# EAGLE design LDAQ-MOD-ENC4 (EAGLE 7.5.0)
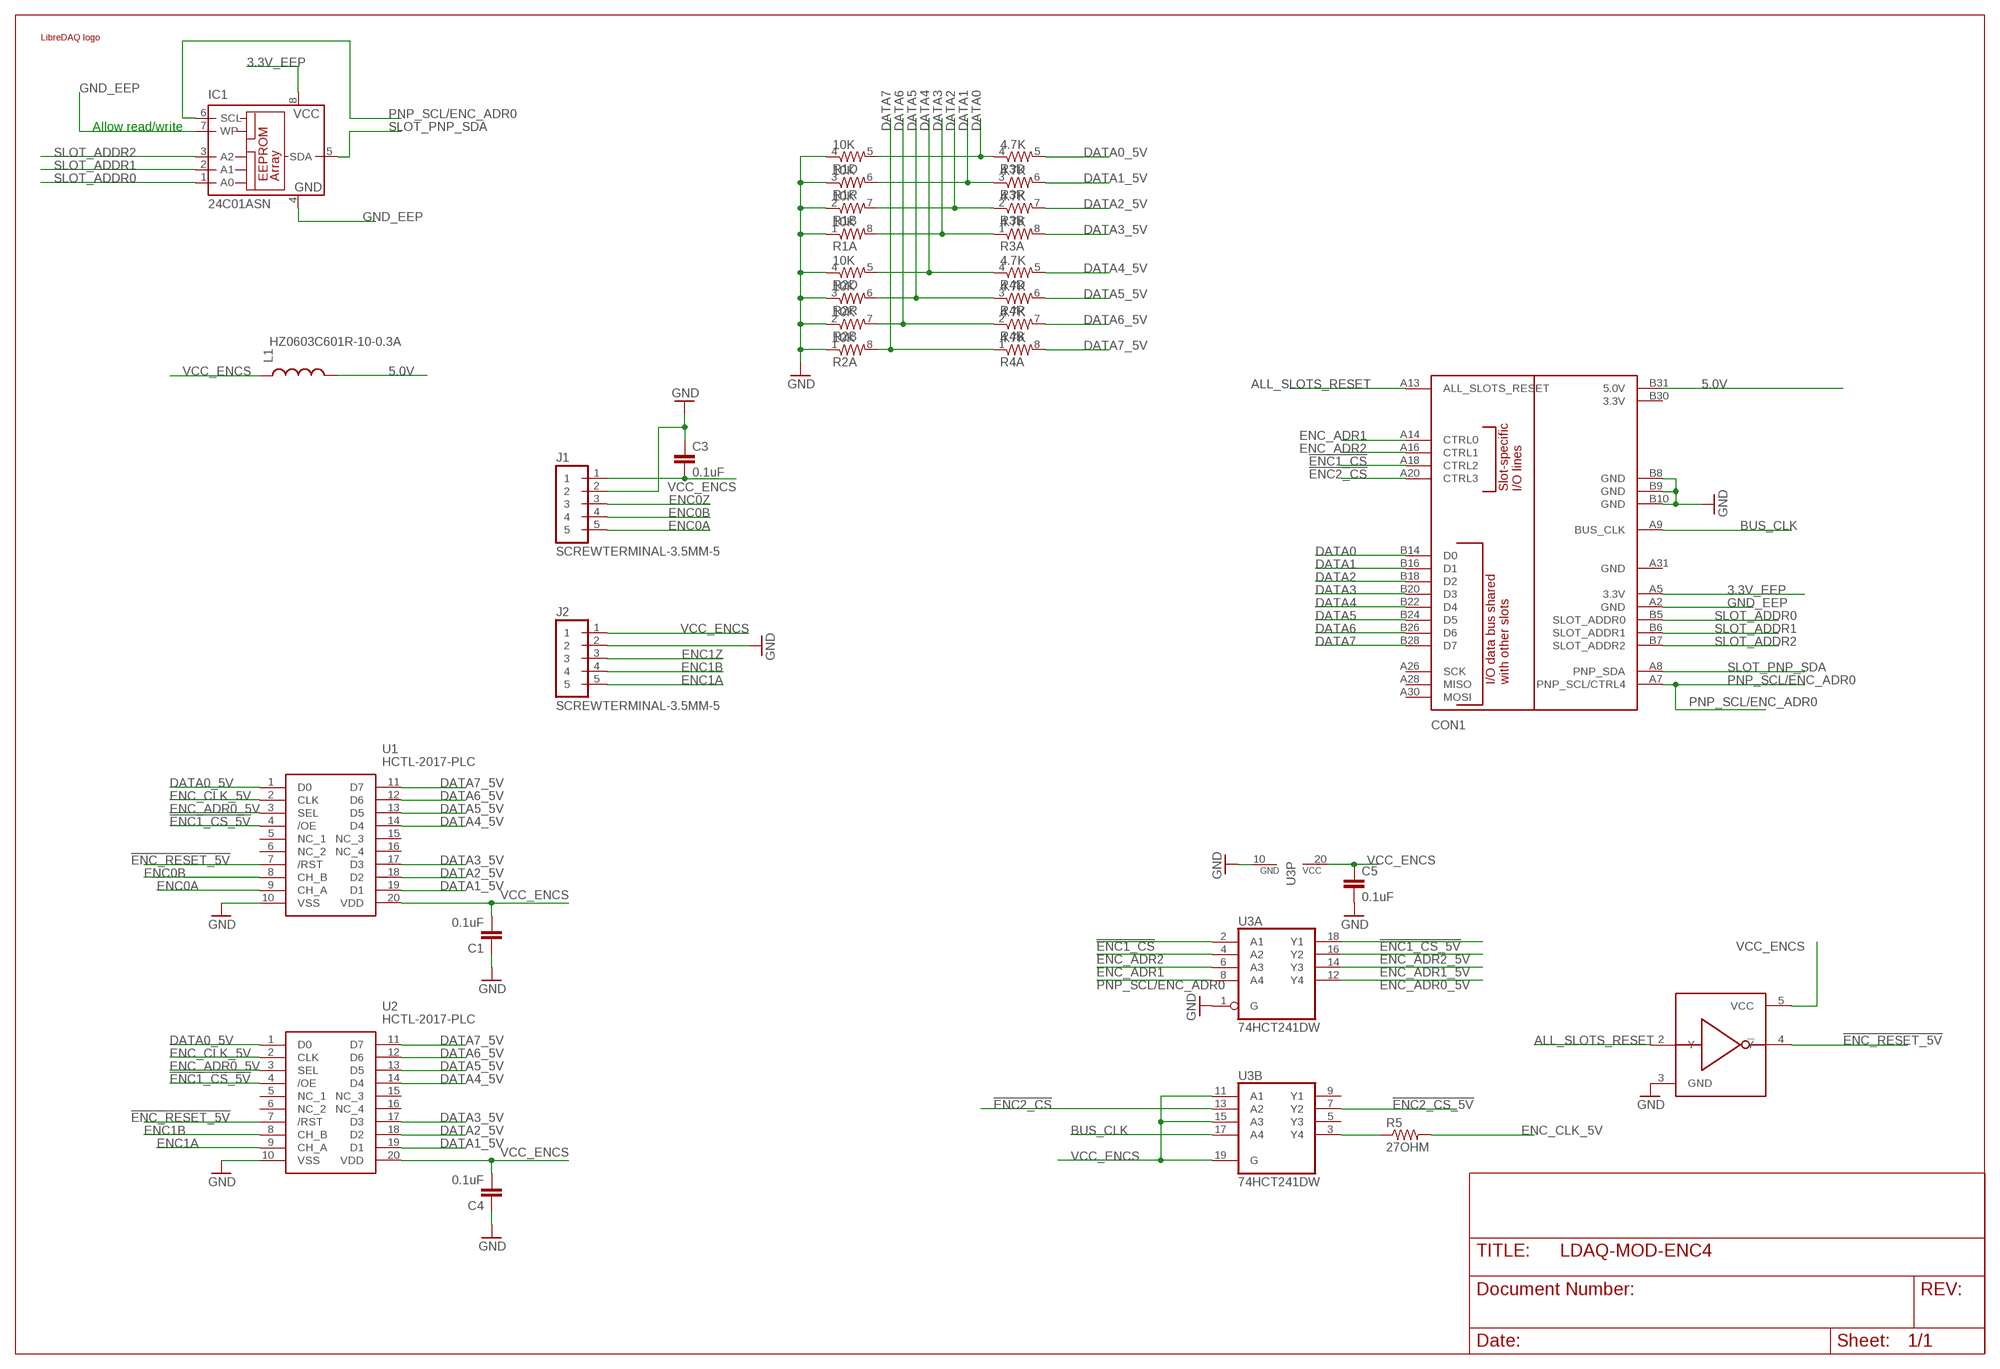
[diagram p0: schematic, sheet 1]

## Parts
C1  0.1uF  0.1UF-25V(+80/-20%)(0603)  [0603-CAP]
C3  0.1uF  0.1UF-25V(+80/-20%)(0603)  [0603-CAP]
C4  0.1uF  0.1UF-25V(+80/-20%)(0603)  [0603-CAP]
C5  0.1uF  0.1UF-25V(+80/-20%)(0603)  [0603-CAP]
CON1  BOARD  LIBREDAQ_DAUGHTER_BOARDPCI-64-SIZE1-PADS  [PCI-E_64_EDGE_70X60_PADS-ONLY]
IC1  24C01ASN  [SO-08]
J1  SCREWTERMINAL-3.5MM-5  [SCREWTERMINAL-3.5MM-5]
J2  SCREWTERMINAL-3.5MM-5  [SCREWTERMINAL-3.5MM-5]
L1  HZ0603C601R-10-0.3A  INDUCTOR0603  [0603]
LOGO1  LIBREDAQ_LOGO_MINILOGO_GENERIC  [LIBREDAQ_LOGO]
R1  10K  RESISTOR-ARRAY0603-ARV  [0603-ARV]
R2  10K  RESISTOR-ARRAY0603-ARV  [0603-ARV]
R3  4.7K  RESISTOR-ARRAY0603-ARV  [0603-ARV]
R4  4.7K  RESISTOR-ARRAY0603-ARV  [0603-ARV]
R5  27OHM  33OHM1/10W1%(0603)  [0603]
U1  HCTL-2017-PLC  [PLCC127P991X991X457-20N]
U2  HCTL-2017-PLC  [PLCC127P991X991X457-20N]
U3  74HCT241DW  [SO20W]
U4  74AHCT1G04  [SOT353-SC70-5]

## Nets
3.3V_EEP: CON1.A5(3.3V) IC1.8(VCC)
5.0V: CON1.B31(5.0V) L1.2
!ENC1_CS: CON1.A18(CTRL2) U3.2(A:A1)
!ENC1_CS_5V: U1.4(/OE) U2.4(/OE) U3.18(A:Y1)
!ENC2_CS: CON1.A20(CTRL3) U3.13(B:A2)
!ENC2_CS_5V: U3.7(B:Y2)
!ENC_RESET_5V: U1.7(/RST) U2.7(/RST) U4.4(!Y)
ALL_SLOTS_RESET: CON1.A13(ALL_SLOTS_RESET) U4.2(Y)
BUS_CLK: CON1.A9(BUS_CLK) U3.17(B:A4)
DATA0: CON1.B14(D0) R1.5 R3.4
DATA0_5V: R3.5 U1.1(D0) U2.1(D0)
DATA1: CON1.B16(D1) R1.6 R3.3
DATA1_5V: R3.6 U1.19(D1) U2.19(D1)
DATA2: CON1.B18(D2) R1.7 R3.2
DATA2_5V: R3.7 U1.18(D2) U2.18(D2)
DATA3: CON1.B20(D3) R1.8 R3.1
DATA3_5V: R3.8 U1.17(D3) U2.17(D3)
DATA4: CON1.B22(D4) R2.5 R4.4
DATA4_5V: R4.5 U1.14(D4) U2.14(D4)
DATA5: CON1.B24(D5) R2.6 R4.3
DATA5_5V: R4.6 U1.13(D5) U2.13(D5)
DATA6: CON1.B26(D6) R2.7 R4.2
DATA6_5V: R4.7 U1.12(D6) U2.12(D6)
DATA7: CON1.B28(D7) R2.8 R4.1
DATA7_5V: R4.8 U1.11(D7) U2.11(D7)
ENC0A: J1.5 U1.9(CH_A)
ENC0B: J1.4 U1.8(CH_B)
ENC0Z: J1.3
ENC1A: J2.5 U2.9(CH_A)
ENC1B: J2.4 U2.8(CH_B)
ENC1Z: J2.3
ENC_ADR0_5V: U1.3(SEL) U2.3(SEL) U3.12(A:Y4)
ENC_ADR1: CON1.A14(CTRL0) U3.6(A:A3)
ENC_ADR1_5V: U3.14(A:Y3)
ENC_ADR2: CON1.A16(CTRL1) U3.4(A:A2)
ENC_ADR2_5V: U3.16(A:Y2)
ENC_CLK_5V: R5.2 U1.2(CLK) U2.2(CLK)
GND: C1.1 C3.1 C4.1 C5.2 CON1.B8(GND) CON1.B9(GND) CON1.B10(GND) J1.2 J2.2 R1.1 R1.2 R1.3 R1.4 R2.1 R2.2 R2.3 R2.4 U1.10(VSS) U2.10(VSS) U3.1(A:G) U3.10(P:GND) U4.3(GND)
GND_EEP: CON1.A2(GND) IC1.4(GND) IC1.7(WP)
N$1: R5.1 U3.3(B:Y4)
PNP_SCL/ENC_ADR0: CON1.A7(PNP_SCL/CTRL4) IC1.6(SCL) U3.8(A:A4)
SLOT_ADDR0: CON1.B5(SLOT_ADDR0) IC1.1(A0)
SLOT_ADDR1: CON1.B6(SLOT_ADDR1) IC1.2(A1)
SLOT_ADDR2: CON1.B7(SLOT_ADDR2) IC1.3(A2)
SLOT_PNP_SDA: CON1.A8(PNP_SDA) IC1.5(SDA)
VCC_ENCS: C1.2 C3.2 C4.2 C5.1 J1.1 J2.1 L1.1 U1.20(VDD) U2.20(VDD) U3.11(B:A1) U3.15(B:A3) U3.19(B:G) U3.20(P:VCC) U4.5(VCC)
Unconnected: CON1.A26(SCK) CON1.A28(MISO) CON1.A30(MOSI) CON1.A31(GND) CON1.B30(3.3V) U1.5(NC_1) U1.6(NC_2) U1.15(NC_3) U1.16(NC_4) U2.5(NC_1) U2.6(NC_2) U2.15(NC_3) U2.16(NC_4) U3.5(B:Y3) U3.9(B:Y1)

## Notes on the sheet
- Allow read/write

## Library data of the parts
C1 C3-C5 = SparkFun-Capacitors:0.1UF-25V(+80/-20%)(0603): CAP-00810 Ceramic Standard decoupling cap; PROD_ID: CAP-00810
CON1 = libredaq-comps:LIBREDAQ_DAUGHTER_BOARD: LibreDAQ Expansion board (PCI-E form)
IC1 = libredaq-comps:24C*: Serial EEPROM 1 K/2 K/4 K; MPN: AT24C01BN-SH-B; OC_FARNELL: 1362638; OC_NEWARK: 50M3313
J1 J2 = libredaq-comps:SCREWTERMINAL-3.5MM-5
L1 = SparkFun-Passives:INDUCTOR: Inductors Basic Inductor/Choke - 0603 and 1206. Footprints are not proven and vary greatly between part numbers. SRN6045- 33uH, 20% 1.4A SDR0403-560KL - 56uH, 10%, 500mA RMS/740mA peak
LOGO1 = libredaq-comps:LIBREDAQ_LOGO_MINI
R1-R4 = SparkFun-Resistors:RESISTOR-ARRAY: Array Chip Resistor Source: RS Component / Phycomp
R5 = SparkFun-Resistors:33OHM1/10W1%(0603): RES-08270; PROD_ID: RES-08270; VALUE: 33OHM
U1 U2 = SamacSys_Parts:HCTL-2017-PLC: Avago, Motion Control, HCTL-2017-PLC Broadcom HCTL-2017-PLC, Dual, Counter, Decoder, 1-of-8, Inverting, 4.5 to 5.5 V, 20-Pin PLCC Source: Datasheet <https://docs.broadcom.com/docs/AV01-0041EN>; DESCRIPTION: Avago, Motion Control, HCTL-2017-PLC Broadcom HCTL-2017-PLC, Dual, Counter, Decoder, 1-of-8, Inverting, 4.5 to 5.5 V, 20-Pin PLCC; HEIGHT: 4.572mm; MANUFACTURER_NAME: Avago Technologies; MANUFACTURER_PART_NUMBER: HCTL-2017-PLC
U3 = libredaq-comps:74*241: Octal BUFFER and LINE DRIVER, 3-state
U4 = libredaq-comps:74AHCT1G04: 74AHCT1G04SE: 1 gate inverter

## Board
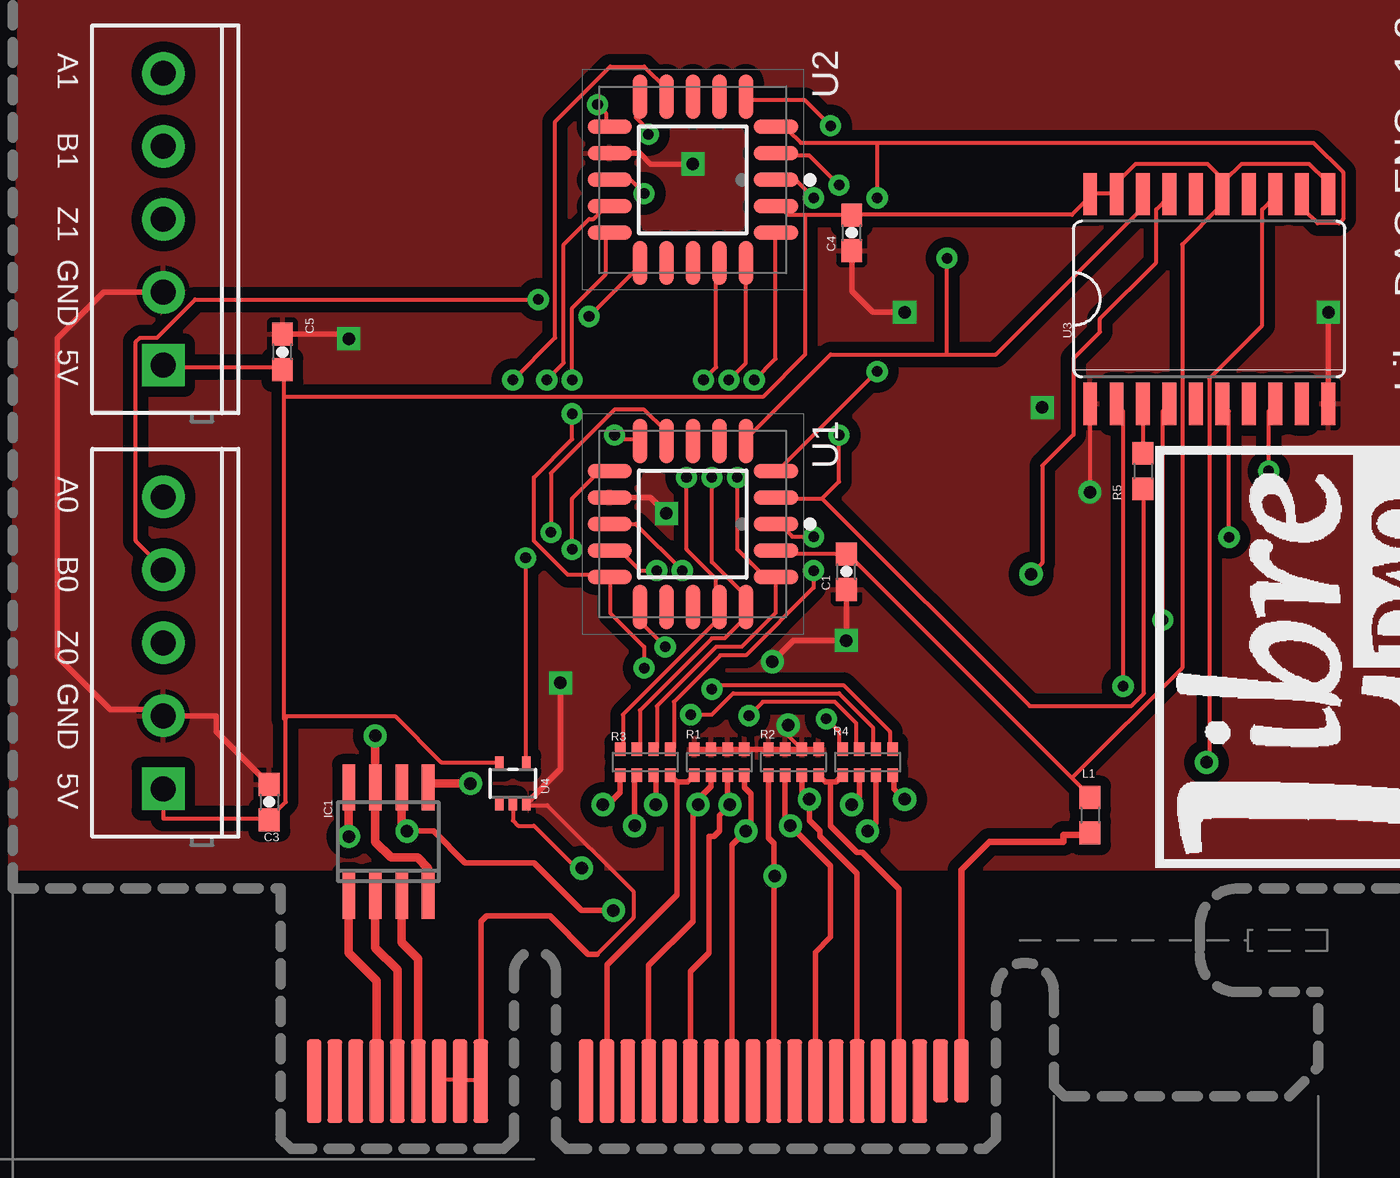
[diagram p1: board, top side]
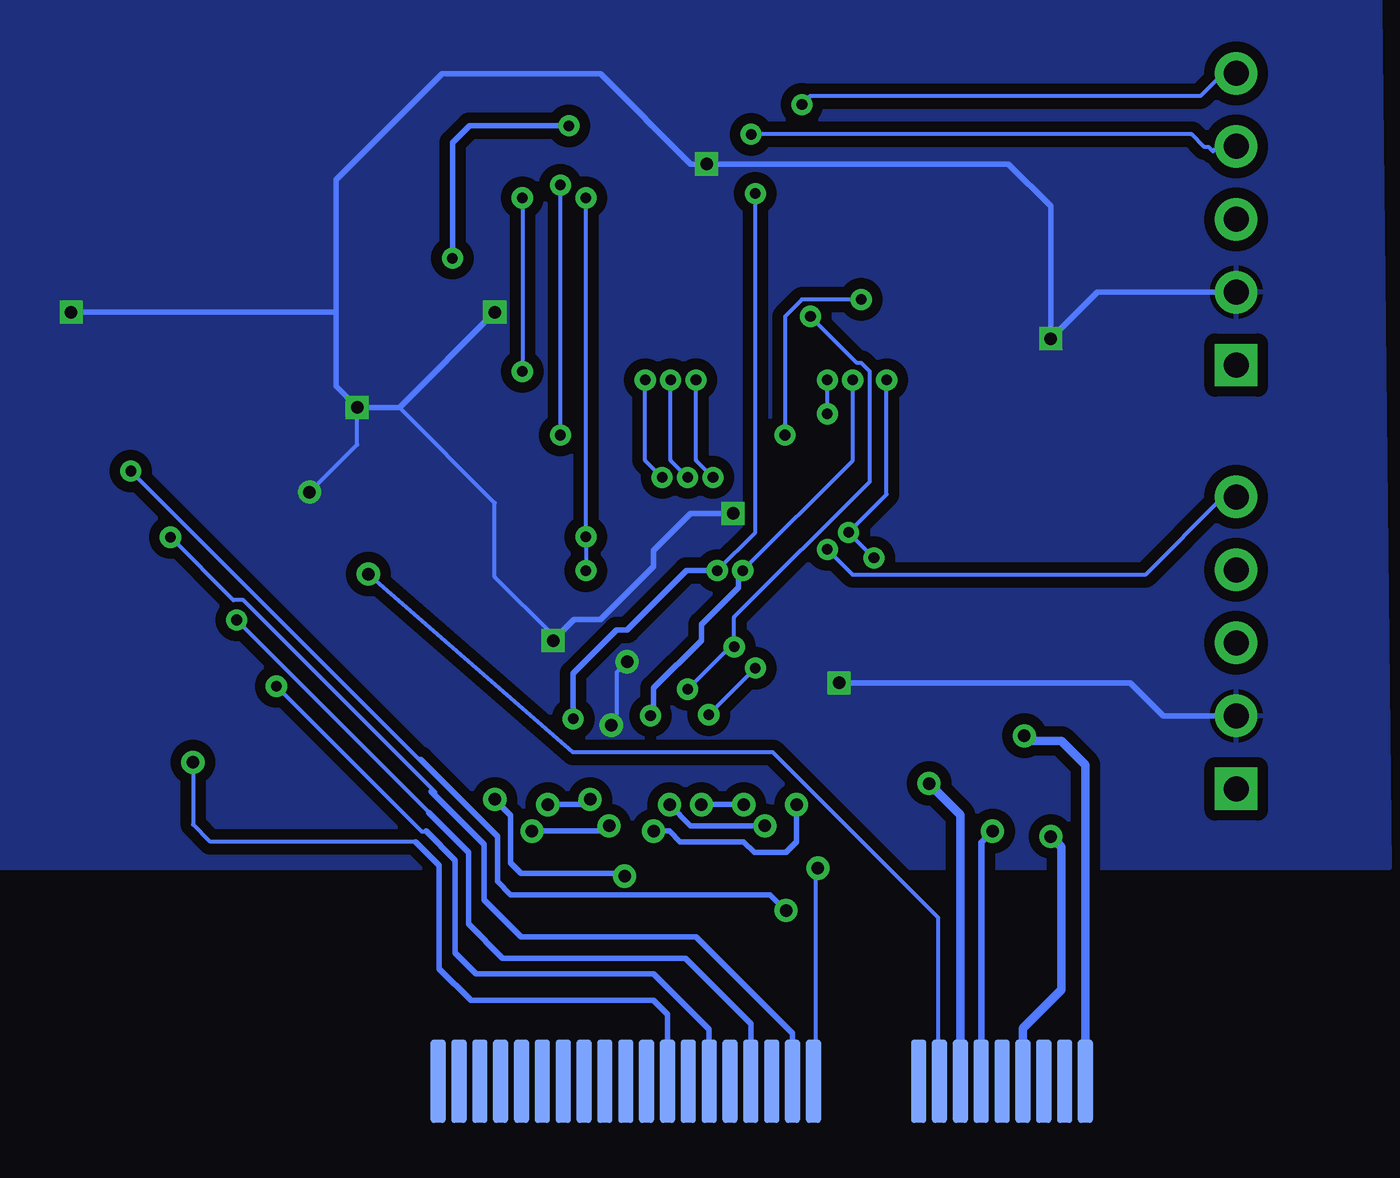
[diagram p2: board, bottom side, seen from below]

No outline drawn. Coordinates in mm, seen from the top.
Copper layers (1*16): Top 0.035mm / dielectric 1.5mm / Bottom 0.035mm
Design rules "LibreDAQ": minimum track width 8mil, minimum drill 20mil, track to track 8mil, track to pad 7mil, pad to pad 7mil, via to via 8mil, smd to smd 7mil, copper to edge 6mil, drill to drill 8mil, minimum pad ring 12mil, minimum via ring 10mil, stop-mask expansion 4mil, vias tented up to drill 25mil, thermal gap 10mil
tKeepout: 31 lines
bKeepout: 32 lines

### Footprints (pad centres in the part's own frame; a part is rotated, then mirrored left to right if it is on the bottom)
0603-CAP = smd 1.1 x 1: 1 -0.85,0; 2 0.85,0
PCI-E_64_EDGE_70X60_PADS-ONLY = smd 0.7 x 4 bottom: A2 -10.55,3.75; A3 -9.55,3.75; A4 -8.55,3.75; A5 -7.55,3.75; A6 -6.55,3.75; A7 -5.55,3.75; A8 -4.55,3.75; A9 -3.55,3.75; A10 -2.55,3.75; A13 2.5,3.75; A14 3.5,3.75; A15 4.5,3.75; A16 5.5,3.75; A17 6.5,3.75; A18 7.5,3.75; A19 8.5,3.75; A20 9.5,3.75; A21 10.5,3.75; A22 11.5,3.75; A23 12.5,3.75; A24 13.5,3.75; A25 14.5,3.75; A26 15.5,3.75; A27 16.5,3.75; A28 17.5,3.75; A29 18.5,3.75; A30 19.5,3.75; A31 20.5,3.75 | smd 0.7 x 4: B2 -10.55,3.75; B3 -9.55,3.75; B4 -8.55,3.75; B5 -7.55,3.75; B6 -6.55,3.75; B7 -5.55,3.75; B8 -4.55,3.75; B9 -3.55,3.75; B10 -2.55,3.75; B13 2.5,3.75; B14 3.5,3.75; B15 4.5,3.75; B16 5.5,3.75; B17 6.5,3.75; B18 7.5,3.75; B19 8.5,3.75; B20 9.5,3.75; B21 10.5,3.75; B22 11.5,3.75; B23 12.5,3.75; B24 13.5,3.75; B25 14.5,3.75; B26 15.5,3.75; B27 16.5,3.75; B28 17.5,3.75; B29 18.5,3.75 | smd 0.7 x 3: B30 19.5,4.25; B31 20.5,4.25
SO-08 = smd 0.6 x 2.2: 1 -1.905,-2.6; 2 -0.635,-2.6; 3 0.635,-2.6; 4 1.905,-2.6; 5 1.905,2.6; 6 0.635,2.6; 7 -0.635,2.6; 8 -1.905,2.6
SCREWTERMINAL-3.5MM-5 = drill 1.2 pad 2.032 square: 1 0,0 | drill 1.2 pad 2.032: 2 3.5,0; 3 7,0; 4 10.5,0; 5 14,0
0603 = smd 1.1 x 1: 1 -0.85,0; 2 0.85,0
0603-ARV = smd 0.5 x 0.65: 1 -1.2,-0.625; 2 -0.4,-0.625; 3 0.4,-0.625; 4 1.2,-0.625; 5 1.2,0.625; 6 0.4,0.625; 7 -0.4,0.625; 8 -1.2,0.625
PLCC127P991X991X457-20N = smd 0.7 x 2.129: 1 0,3.986; 2 -1.27,3.986; 3 -2.54,3.986; 9 -2.54,-3.986; 10 -1.27,-3.986; 11 0,-3.986; 12 1.27,-3.986; 13 2.54,-3.986; 19 2.54,3.986; 20 1.27,3.986 | smd 2.129 x 0.7: 4 -3.986,2.54; 5 -3.986,1.27; 6 -3.986,0; 7 -3.986,-1.27; 8 -3.986,-2.54; 14 3.986,-2.54; 15 3.986,-1.27; 16 3.986,0; 17 3.986,1.27; 18 3.986,2.54
SO20W = smd 0.66 x 2.032: 1 -5.715,-5.029; 2 -4.445,-5.029; 3 -3.175,-5.029; 4 -1.905,-5.029; 5 -0.635,-5.029; 6 0.635,-5.029; 7 1.905,-5.029; 8 3.175,-5.029; 9 4.445,-5.029; 10 5.715,-5.029; 11 5.715,5.029; 12 4.445,5.029; 13 3.175,5.029; 14 1.905,5.029; 15 0.635,5.029; 16 -0.635,5.029; 17 -1.905,5.029; 18 -3.175,5.029; 19 -4.445,5.029; 20 -5.715,5.029
SOT353-SC70-5 = smd 0.42 x 0.7: 1 -0.65,-0.95; 2 0,-0.95; 3 0.65,-0.95; 4 0.65,0.95; 5 -0.65,0.95

### Placement (x,y rotation side)
C1  40.39,28.19 90 top
C3  12.7,17.14 270 top
C4  40.64,44.45 90 top
C5  13.34,38.73 90 top
CON1  25.4,0 0 top
IC1  18.41,15.24 0 top
J1  7.62,17.78 90 top
J2  7.62,38.1 90 top
L1  52.07,16.51 270 top
LOGO1  70.1,13.97 90 top
R1  34.29,19.05 180 top
R2  37.85,19.05 180 top
R3  30.73,19.05 0 top
R4  41.4,19.05 0 top
R5  54.61,33.02 270 top
U1  33.02,30.48 270 top
U2  33.02,46.99 270 top
U3  57.78,41.27 0 top
U4  24.38,18.03 0 top

### Tracks (layer width: path | path; a pad name or v marks a point on that pad's centre or on a via)
3.3V_EEP  (via drill 0.6)
  Top 0.406: v16.51,15.49 IC1.8
  Bottom 0.406: CON1.A5 17.85,6.28 16,8.13 16,14.99 v16.51,15.49
5.0V
  Top 0.203: 52.07,15.56 L1.2
  Top 0.305: 52.07,15.56 50.8,15.56 50.8,15.24 47.24,15.24 45.9,13.9 CON1.B31
!ENC1_CS  (via drill 0.51)
  Top 0.203: v53.66,22.7 53.66,35.88 53.34,36.2 U3.2
  Bottom 0.203: v53.66,22.7 46.67,15.72 46.51,15.72 46.48,15.75
  Bottom 0.254: 46.48,15.75 45.09,14.35 45.09,9.91 44.07,8.89 35.56,8.89 32.9,6.23 CON1.A18
!ENC1_CS_5V  (via drill 0.51)
  Top 0.203: 45.21,38.61 39.62,38.61 35.56,34.54 U1.4 | 45.21,38.61 47.55,38.61 54.46,45.52 54.46,46.13 U3.18 | v39.62,49.58 38.41,50.8 35.56,50.8 U2.4 | 45.21,38.61 v45.21,43.23
  Bottom 0.254: v39.62,49.58 44.4,49.58 45.21,48.77 v45.21,43.23
!ENC2_CS  (via drill 0.6)
  Top 0.203: U3.13 60.96,46.2 60.33,45.56 60.33,40.01 57.78,37.47 57.78,19.18 v57.66,19.05
  Bottom 0.203: 46.99,15.24 56.83,15.24 57.66,16.07 v57.66,19.05
  Bottom 0.254: 46.99,15.24 45.85,14.1 45.85,9.14 44.32,7.62 35.56,7.62 34.9,6.96 CON1.A20
!ENC_RESET_5V  (via drill 0.51)
  Top 0.203: v24.99,28.85 24.99,19.1 U4.4 | v26.21,30.07 26.21,32.92 29.26,35.97 30.68,35.97 31.7,34.95 31.7,34.54 U1.7 | v24.38,37.39 26.42,39.42 26.42,49.78 29.06,52.43 30.68,52.43 31.7,51.41 31.7,51 U2.7
  Bottom 0.203: v24.99,28.85 v26.21,30.07 24.38,31.9 v24.38,37.39
ALL_SLOTS_RESET  (via drill 0.6)
  Top 0.203: v27.69,13.97 27.43,13.97 25.4,16 24.64,16 24.38,16.26 U4.2
  Bottom 0.203: CON1.A13 27.78,3.81 27.78,13.88 v27.69,13.97
BUS_CLK  (via drill 0.6)
  Top 0.203: U3.17 55.88,46.2 55.24,45.56 55.24,43.02 52.55,40.32 52.55,39.69 51.28,38.42 51.28,34.77 49.78,33.27 49.78,28.61 v49.25,28.08
  Bottom 0.203: v49.25,28.08 39.43,19.53 29.84,19.53 21.91,11.59 21.91,3.81 CON1.A9 | v49.25,28.08 49.34,28.16 v49.26,28.08 v49.25,28.08
DATA0
  Top 0.254: 32.26,18.1 32.26,12.7 28.9,9.34 CON1.B14 | 32.26,18.1 R3.4 | 32.26,18.1 32.77,18.1 R1.5
DATA0_5V  (via drill 0.51)
  Top 0.203: v38.81,28.25 38.81,27.43 35.56,24.18 34.34,24.18 32.11,21.95 32.11,19.71 R3.5 | v38.81,29.87 37.8,29.87 37.19,30.48 U1.1 | v38.81,46.13 38,46.94 37.19,46.94 U2.1
  Bottom 0.203: v38.81,28.25 v38.81,29.87 v38.81,46.13
DATA1  (via drill 0.6)
  Top 0.254: v31.24,17.02 31.24,18.32 R3.3 | 33.78,18.32 R1.6 33.89,17.89 33.27,17.27 v33.27,17.02 33.02,16.51 33.02,11.43 30.9,9.31 CON1.B16
  Bottom 0.254: v33.27,17.02 v31.24,17.02
DATA1_5V  (via drill 0.51)
  Top 0.203: R3.6 31.29,19.71 31.29,21.74 34.14,24.59 35.36,24.59 36.98,26.21 36.98,27.84 U1.19 36.98,28.04 36.37,28.04 35.15,29.26 v35.15,32.72 | v35.97,37.39 36.98,38.41 36.98,44.3 U2.19
  Bottom 0.203: v35.97,37.39 35.97,33.53 v35.15,32.72
DATA2  (via drill 0.6)
  Top 0.254: v30.23,16 30.23,18.32 R3.2 | R1.7 34.69,17.13 v34.8,17.02 34.29,16.51 34.29,15.75 34.04,15.49 33.78,15.49 33.78,9.91 32.9,9.02 CON1.B18
  Bottom 0.254: v30.23,16 33.78,16 v34.8,17.02
DATA2_5V  (via drill 0.51)
  Top 0.203: R3.7 30.48,19.71 30.48,21.54 33.93,24.99 34.54,24.99 35.56,26.01 U1.18 35.56,27.03 33.93,28.65 v33.93,32.72 | U2.18 35.56,38.2 v34.75,37.39
  Bottom 0.203: v34.75,37.39 34.75,33.53 v33.93,32.72
DATA3  (via drill 0.6)
  Top 0.254: R1.8 35.49,17.85 35.81,17.53 35.81,16 v35.56,15.75 34.9,15.09 CON1.B20 | v28.7,17.02 28.96,17.02 29.53,17.6 R3.1
  Bottom 0.254: v35.56,15.75 34.8,15.75 34.29,15.24 31.24,15.24 30.73,14.73 29.21,14.73 28.7,15.24 v28.7,17.02
DATA3_5V  (via drill 0.51)
  Top 0.203: R3.8 29.67,19.71 29.67,21.34 34.14,25.81 34.14,26.42 U1.17 34.14,26.62 34.14,27.84 32.72,29.26 v32.72,32.72 | v33.53,37.39 34.14,38 34.14,42.88 U2.17
  Bottom 0.203: v33.53,37.39 33.53,33.53 v32.72,32.72
DATA4  (via drill 0.6)
  Top 0.254: v43.18,17.27 42.67,17.78 42.67,18.36 R4.4 | R2.5 36.65,15.42 36.9,15.17 36.9,13.65 v36.96,13.59 36.9,13.53 CON1.B22
  Bottom 0.254: v43.18,17.27 42.42,16.51 42.42,14.22 41.91,13.72 37.08,13.72 v36.96,13.59
DATA4_5V  (via drill 0.51)
  Top 0.203: v33.93,22.55 34.14,22.76 40.23,22.76 42.47,20.52 42.47,19.71 R4.5 | v31.7,24.59 30.48,25.81 U1.14 | v28.04,40.44 30.48,42.88 U2.14
  Bottom 0.203: v33.93,22.55 31.9,24.59 v31.7,24.59 31.7,26.01 25.2,32.51 25.2,37.8 25.6,38.2 25.81,38.2 v28.04,40.44
DATA5  (via drill 0.6)
  Top 0.254: R4.3 41.8,16.15 v41.4,15.75 | R2.6 37.45,16.26 v37.7,16 39.62,14.08 39.62,10.67 38.9,9.94 CON1.B24
  Bottom 0.254: v41.4,15.75 37.95,15.75 v37.7,16
DATA5_5V  (via drill 0.51)
  Top 0.203: v32.92,21.34 33.93,21.34 34.95,22.35 40.03,22.35 41.66,20.73 41.66,19.71 R4.6 | v30.68,23.57 30.68,24.59 29.06,26.21 29.06,27.84 U1.13 28.85,28.04 27.03,28.04 25.4,29.67 25.4,32.72 27.23,34.54 v27.23,35.76 | v27.23,37.39 27.23,40.84 28.85,42.47 28.85,44.3 U2.13
  Bottom 0.203: v30.68,23.57 v32.92,21.34 | v27.23,35.76 v27.23,37.39
DATA6  (via drill 0.6)
  Top 0.254: R4.2 41,17.38 v40.64,17.02 | v38.61,17.27 38.35,17.53 | R2.7 38.25,17.63 v38.61,17.27 | v38.61,17.27 38.61,16.26 39.12,15.75 39.12,15.49 40.9,13.71 CON1.B26
  Bottom 0.254: v40.64,17.02 38.86,17.02 v38.61,17.27
DATA6_5V  (via drill 0.51)
  Top 0.203: v31.29,28.25 30.48,28.25 29.67,29.06 29.06,29.06 U1.12 | R4.7 40.84,19.71 40.84,20.93 39.83,21.95 36.37,21.95 v35.71,21.29 | v26.01,37.39 26.82,38.2 26.82,43.89 28.04,45.11 28.25,45.11 28.85,45.72 U2.12
  Bottom 0.203: v26.01,37.39 26.01,33.53 v31.29,28.25
  Bottom 0.254: v31.29,28.25 31.5,28.04 31.5,27.43 33.27,25.65 33.27,24.89 35.56,22.61 35.56,21.44 v35.71,21.29
DATA7
  Top 0.254: R2.8 39.37,18.1 39.62,18.1 | 39.62,18.1 39.88,18.1 R4.1 | 39.62,18.1 39.62,16 40.89,14.73 41.15,14.73 42.9,12.98 CON1.B28
DATA7_5V  (via drill 0.51)
  Top 0.203: v39.42,21.13 40.03,20.52 40.03,19.71 R4.8 | v32.51,28.25 30.28,30.48 U1.11 | v30.68,46.33 30.07,46.94 29.06,46.94 U2.11
  Bottom 0.203: v30.68,46.33 30.68,30.07 v32.51,28.25
  Bottom 0.254: v32.51,28.25 33.98,28.25 36.83,25.4 37.34,25.4 39.42,23.32 v39.42,21.13
ENC0A  (via drill 0.51)
  Top 0.203: v27.23,29.26 27.23,31.7 28.45,32.92 28.85,32.92 U1.9
  Bottom 0.203: v27.23,29.26 26.01,28.04 11.99,28.04 8.33,31.7 7.72,31.7 J1.5
ENC0B  (via drill 0.51)
  Top 0.203: v29.26,34.75 29.46,34.54 30.48,34.54 U1.8 | v25.6,41.25 9.14,41.25 7.32,39.42 6.5,39.42 6.3,39.22 6.3,29.67 7.52,28.45 J1.4
  Bottom 0.203: v29.26,34.75 29.26,40.44 28.45,41.25 v25.6,41.25
ENC1A  (via drill 0.51)
  Top 0.203: v28.45,50.6 28.85,50.19 28.85,49.58 U2.9
  Bottom 0.203: v28.45,50.6 28.04,51 9.35,51 8.33,52.02 7.72,52.02 J2.5
ENC1B  (via drill 0.51)
  Top 0.203: U2.8 30.48,50.19 30.28,49.99 30.89,49.38 v30.89,49.17
  Bottom 0.203: v30.89,49.17 9.75,49.17 9.14,48.56 8.94,48.56 8.74,48.36 8.53,48.56 7.72,48.56 J2.4
ENC_ADR0_5V  (via drill 0.51)
  Top 0.203: 41.86,48.77 38.2,48.77 37.59,49.38 37.19,49.38 U2.3 | 41.86,48.77 62.79,48.77 64.21,47.35 64.21,45.11 64.01,44.91 62.99,44.91 62.38,45.52 62.38,46.13 U3.12 | v41.86,37.8 37.19,33.12 U1.3 | 41.86,48.77 v41.86,46.13
  Bottom 0.203: v41.86,46.13 v41.86,37.8
ENC_ADR1  (via drill 0.51)
  Top 0.203: v58.74,29.84 58.74,35.88 58.42,36.2 U3.6
  Bottom 0.203: v58.74,29.84 55.72,26.83 55.24,26.83 46.04,17.62 46.12,17.54
  Bottom 0.254: 46.23,17.65 46.12,17.54 43.69,15.11 43.69,12.45 41.91,10.67 33.53,10.67 28.9,6.04 CON1.A14
ENC_ADR2  (via drill 0.51)
  Top 0.203: v55.56,25.88 55.56,35.88 55.88,36.2 U3.4
  Bottom 0.203: v55.56,25.88 46.35,16.67 46.35,16.64
  Bottom 0.254: 46.35,16.64 44.45,14.73 44.45,11.3 42.8,9.65 34.04,9.65 30.9,6.52 CON1.A16
ENC_CLK_5V  (via drill 0.51)
  Top 0.203: 39.22,31.7 49.17,21.74 54.05,21.74 54.66,22.35 54.66,32.11 R5.2 | 39.22,31.7 37.19,31.7 U1.2 | v40.03,46.74 38.61,48.16 37.19,48.16 U2.2 | v40.03,34.75 40.03,32.51 39.22,31.7
  Bottom 0.203: v40.03,34.75 v40.03,46.74
GND  (via drill 0.6)
  Top 0.203: CON1.B8 20.95,3.81 21.75,3.81 CON1.B9 21.91,3.81 22.7,3.81 CON1.B10 22.86,3.81 | 28.42,9.84 30.16,11.59 30.16,12.86 26.04,16.99 25.08,16.99 U4.3 | v37.59,20.83 37.59,20.33 R2.2 | 51.89,36.07 52.07,35.89 v52.07,32
  Top 0.254: R1.4 R1.3 R1.2 R1.1 R2.4 R2.3 R2.2 R2.1 | v16.51,39.37 16.3,39.59 C5.2 | U2.10 30.48,48.26 30.99,47.75 v33.02,47.75 | 51.89,36.07 U3.1 | U3.10 v63.5,40.64 | U1.10 30.99,31.75 v31.75,30.99 | C1.1 v40.39,24.89 37.85,24.89 v36.83,23.88 | C4.1 40.64,41.66 41.66,40.64 v43.18,40.64 | U4.3 26.67,18.72 v26.67,22.86 | C3.1 10.16,20.54 10.16,21.28 J1.2 7.31,21.59 5.08,21.59 2.54,24.13 2.54,39.37 4.77,41.6 J2.2 | 28.42,9.84 28,9.84 26.16,11.68 23.11,11.68 22.86,11.43 CON1.B10
  Bottom 0.203: v36.83,23.88 37.34,23.37 37.34,21.08 v37.59,20.83 | v40.39,24.89 40.39,25.15 43.18,27.94 43.18,31.5 47.75,36.07 | v52.07,32 49.78,34.29 v49.78,36.07
  Bottom 0.254: 50.8,40.64 50.8,46.99 45.72,52.07 38.1,52.07 33.78,47.75 v33.02,47.75 18.54,47.75 16.51,45.72 v16.51,39.37 14.28,41.6 J2.2 | 50.8,40.64 50.8,37.08 v49.78,36.07 47.75,36.07 v43.18,40.64 | v63.5,40.64 50.8,40.64 | v31.75,30.99 33.78,30.99 35.56,29.21 35.56,28.45 38.1,25.91 39.37,25.91 v40.39,24.89 | v26.67,22.86 12.7,22.86 11.12,21.28 J1.2
  pour Top (isolate 0.508): 0.76,59.69 0.25,13.97 70.1,13.97 69.85,59.69
  pour Bottom (isolate 0.508): 0.76,59.69 0.25,13.97 70.1,13.97 69.85,59.69
GND_EEP  (via drill 0.6)
  Top 0.203: 17.78,19.05 IC1.7
  Top 0.406: IC1.4 20.32,13.97 19.81,14.48 18.54,14.48 17.78,15.24 IC1.7 | v17.78,20.32 17.78,19.05
  Bottom 0.406: CON1.A2 14.85,18.91 16,20.07 17.53,20.07 v17.78,20.32
N$1
  Top 0.203: U3.3 R5.1
PNP_SCL/ENC_ADR0  (via drill 0.51, 0.6)
  Top 0.203: v60.64,33.02 60.64,35.88 60.96,36.2 U3.8
  Top 0.254: v19.3,15.75 20.57,15.75 22.1,14.22 25.4,14.22 27.69,11.94 v29.21,11.94
  Top 0.406: v19.3,15.75 19.05,16 IC1.6
  Bottom 0.203: v60.64,33.02 46.83,19.21 46.74,19.18
  Bottom 0.254: 46.74,19.18 43.05,15.49 43.05,13.34 42.42,12.7 29.97,12.7 v29.21,11.94
  Bottom 0.305: CON1.A7 19.85,15.2 v19.3,15.75
SLOT_ADDR0
  Top 0.406: CON1.B5 17.85,8.57 16.51,9.91 IC1.1
SLOT_ADDR1
  Top 0.406: CON1.B6 18.85,9.09 17.78,10.16 IC1.2
SLOT_ADDR2
  Top 0.406: CON1.B7 19.85,9.61 19.05,10.41 IC1.3
SLOT_PNP_SDA  (via drill 0.6)
  Top 0.406: v22.35,18.03 20.51,18.03 IC1.5
  Bottom 0.406: CON1.A8 20.85,16.53 v22.35,18.03
VCC_ENCS
  Top 0.203: 13.49,21.13 13.49,17.14 12.7,16.35 | 13.49,21.13 13.49,21.27 18.73,21.27 20.95,19.05 23.65,19.05 U4.5 | 12.7,16.35 7.62,16.35 J1.1 | 12.7,16.35 C3.2 | 13.49,37.62 13.34,37.78 C5.1 | U1.20 37.19,29.06 40.23,29.06 C1.2 40.44,29.06 51.21,18.29 | 51.21,18.29 52.02,17.48 L1.1 | C5.1 13.21,38 7.72,38 J2.1 | 13.41,36.58 13.41,21.13 13.49,21.13 | 13.41,36.58 13.41,37.59 C5.1 | 38.41,45.31 37.59,45.31 37.19,45.72 U2.20 | 38.41,45.31 40.64,45.31 | 58.52,46.94 58.52,46.33 U3.15 | 58.52,46.94 59.33,47.75 62.59,47.75 63.4,46.94 63.4,46.33 U3.11 | 58.52,46.94 57.71,47.75 54.25,47.75 53.44,46.94 53.44,46.33 U3.19 53.24,46.33 52.22,46.33 U3.20 52.02,46.13 51.21,45.31 40.64,45.31 | 58.52,46.94 U3.15 | 40.64,45.31 C4.2 | 13.41,36.58 36.37,36.58 38.41,38.61 38.41,45.31 | 51.21,18.29 56.49,23.57 56.49,43.89 58.32,45.72 58.32,46.13 U3.15

### Text on the board
tPlace: LibreDAQ ENC v1.2
tNames: A1 | B1 | Z1 | GND | 5V | A0 | B0 | Z0 | GND | 5V